# EAGLE design 7seg-2.54 (EAGLE 7.2.0)
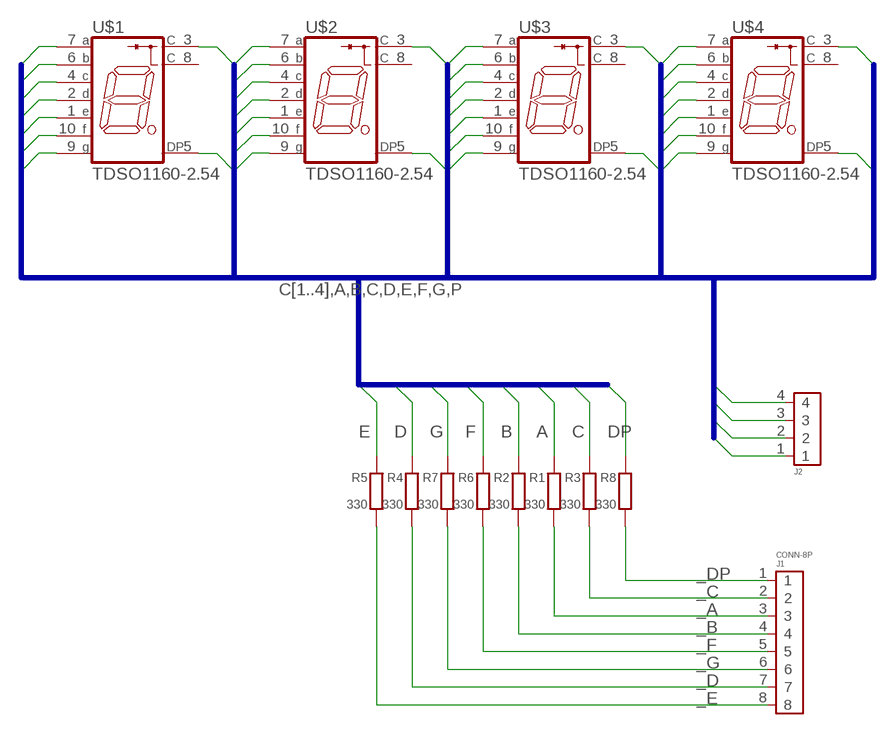
[diagram p0: schematic, sheet 1]

## Parts
J1  CONN-8P  [CONN-8P]
J2  CONN-4P-4P  [CONN-4P]
R1  330  R0202/5-V  [0202/5-V]
R2  330  R0202/5-V  [0202/5-V]
R3  330  R0202/5-V  [0202/5-V]
R4  330  R0202/5-V  [0202/5-V]
R5  330  R0202/5-V  [0202/5-V]
R6  330  R0202/5-V  [0202/5-V]
R7  330  R0202/5-V  [0202/5-V]
R8  330  R0202/5-V  [0202/5-V]
U$1  TDSO1160-2.54  [TDSX1150-2.54]
U$2  TDSO1160-2.54  [TDSX1150-2.54]
U$3  TDSO1160-2.54  [TDSX1150-2.54]
U$4  TDSO1160-2.54  [TDSX1150-2.54]

## Nets
_A: J1.3 R1.2
_B: J1.4 R2.2
_C: J1.2 R3.2
_D: J1.7 R4.2
_DP: J1.1 R8.2
_E: J1.8 R5.2
_F: J1.5 R6.2
_G: J1.6 R7.2
A: R1.1 U$1.7(A) U$2.7(A) U$3.7(A) U$4.7(A)
B: R2.1 U$1.6(B) U$2.6(B) U$3.6(B) U$4.6(B)
C: R3.1 U$1.4(C) U$2.4(C) U$3.4(C) U$4.4(C)
C1: J2.1 U$1.3(C)
C2: J2.2 U$2.3(C)
C3: J2.3 U$3.3(C)
C4: J2.4 U$4.3(C)
D: R4.1 U$1.2(D) U$2.2(D) U$3.2(D) U$4.2(D)
DP: R8.1 U$1.5(DP) U$2.5(DP) U$3.5(DP) U$4.5(DP)
E: R5.1 U$1.1(E) U$2.1(E) U$3.1(E) U$4.1(E)
F: R6.1 U$1.10(F) U$2.10(F) U$3.10(F) U$4.10(F)
G: R7.1 U$1.9(G) U$2.9(G) U$3.9(G) U$4.9(G)
Unconnected: U$1.8(C) U$2.8(C) U$3.8(C) U$4.8(C)

## Buses
C[1..4],A,B,C,D,E,F,G,P

## Library data of the parts
J1 = pinconn:CONN-8P
J2 = pinconn:CONN-4P
R1-R8 = r:R: RESISTOR, European symbol
U$1-U$4 = lcd:TDSO1160

## Board
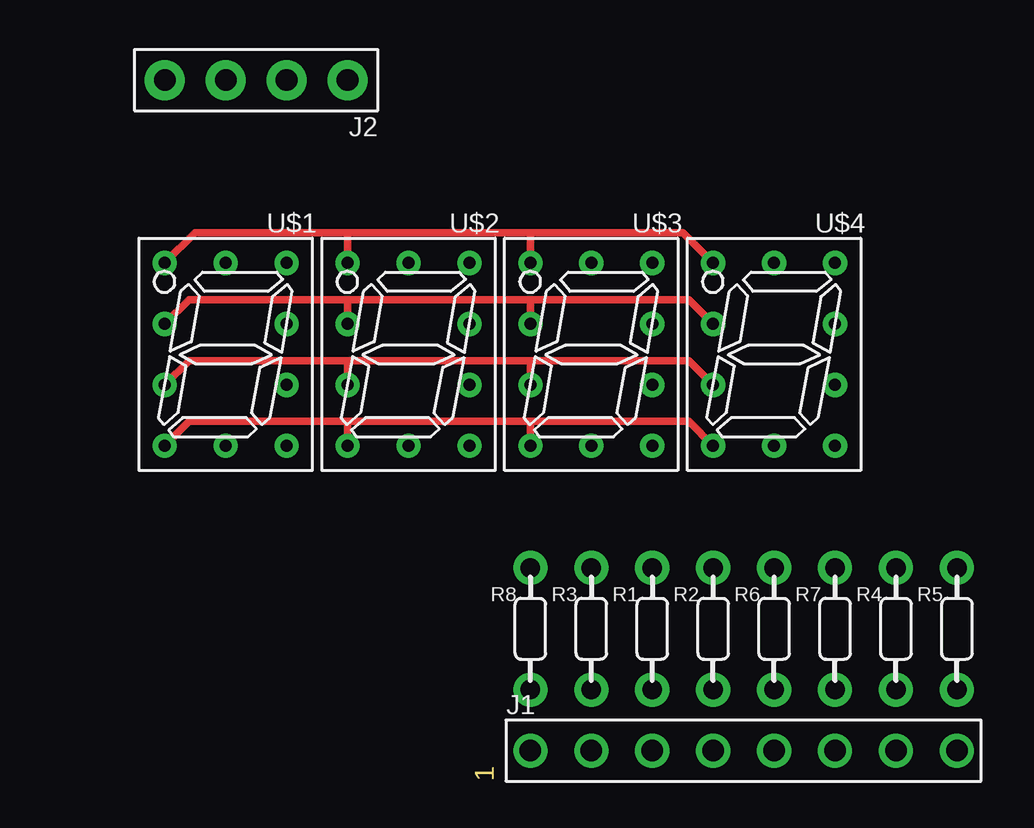
[diagram p1: board, top side]
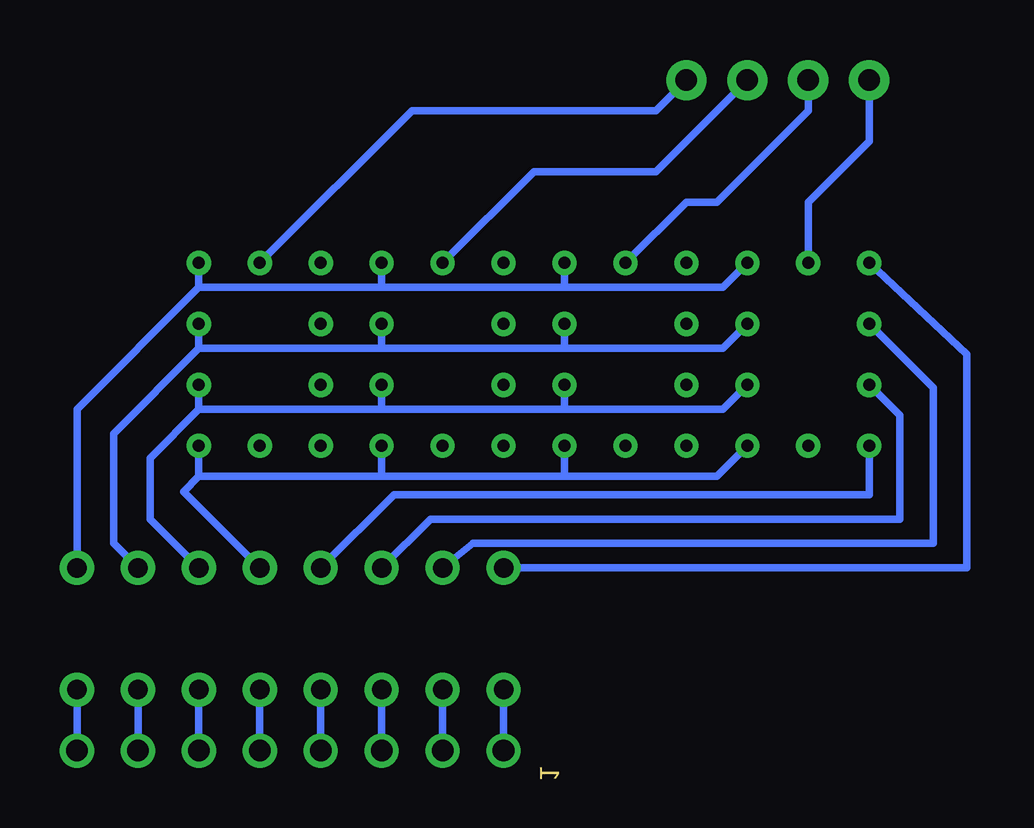
[diagram p2: board, bottom side, seen from below]

No outline drawn. Coordinates in mm, seen from the top.
Copper layers (1*16): Top 0.035mm / dielectric 1.5mm / Bottom 0.035mm
Design rules "default": minimum track width 10mil, minimum drill 24mil, track to track 8mil, track to pad 8mil, pad to pad 8mil, via to via 8mil, smd to smd 8mil, copper to edge 40mil, drill to drill 8mil, minimum pad ring 10mil, minimum via ring 8mil, stop-mask expansion 4mil, vias tented up to drill 0mil, thermal gap 10mil

### Footprints (pad centres in the part's own frame; a part is rotated, then mirrored left to right if it is on the bottom)
CONN-8P = drill 0.9 pad 1.422: 1 0,0; 2 2.54,0; 3 5.08,0; 4 7.62,0; 5 10.16,0; 6 12.7,0; 7 15.24,0; 8 17.78,0
CONN-4P = drill 0.9 pad 1.676: 1 -3.81,0; 2 -1.27,0; 3 1.27,0; 4 3.81,0
0202/5-V = drill 0.813 pad 1.422: 1 0,2.54; 2 0,-2.54
TDSX1150-2.54 = drill 0.5: 1 -2.54,-3.81; 2 -2.54,-1.27; 3 0,-3.81; 4 2.54,-1.27; 5 2.54,-3.81; 6 2.54,3.81; 7 2.54,1.27; 8 0,3.81; 9 -2.54,1.27; 10 -2.54,3.81

### Placement (x,y rotation side)
J1  20.32,2.54 0 top
J2  8.89,30.48 0 top
R1  25.4,7.62 0 top
R2  27.94,7.62 0 top
R3  22.86,7.62 0 top
R4  35.56,7.62 0 top
R5  38.1,7.62 0 top
R6  30.48,7.62 0 top
R7  33.02,7.62 0 top
R8  20.32,7.62 0 top
U$1  7.62,19.05 180 top
U$2  15.24,19.05 180 top
U$3  22.86,19.05 180 top
U$4  30.48,19.05 180 top

### Tracks (layer width: path | path; a pad name or v marks a point on that pad's centre or on a via)
_A
  Bottom 0.305: J1.3 R1.2
_B
  Bottom 0.305: R2.2 J1.4
_C
  Bottom 0.305: R3.2 J1.2
_D
  Bottom 0.305: R4.2 J1.7
_DP
  Bottom 0.305: J1.1 R8.2
_E
  Bottom 0.305: J1.8 R5.2
_F
  Bottom 0.305: J1.5 R6.2
_G
  Bottom 0.305: R7.2 J1.6
A
  Top 0.305: U$1.7 6.1,18.8 9.48,18.8 12.7,18.8 | 12.7,18.8 U$2.7 | U$3.7 | U$3.7 20.32,18.8 | 20.32,18.8 12.7,18.8 | U$4.7 | U$4.7 26.92,18.8 20.32,18.8
  Bottom 0.305: R1.1 23.37,12.19 3.81,12.19 3.81,16.51 U$1.7
B
  Top 0.305: U$1.6 6.1,16.26 12.7,16.26 | U$2.6 12.7,16.26 | 12.7,16.26 20.32,16.26 | U$3.6 20.32,16.26 | 20.32,16.26 26.92,16.26 U$4.6
  Bottom 0.305: R2.1 24.89,13.21 5.08,13.21 U$1.6
C
  Top 0.305: U$1.4 | U$1.4 6.1,21.34 12.7,21.34 | 12.7,21.34 | 12.7,21.34 U$2.4 | U$2.4 | 12.7,21.34 20.32,21.34 | 20.32,21.34 | 20.32,21.34 U$3.4 | U$3.4 | U$3.4 20.32,21.34 | 20.32,21.34 26.92,21.34 U$4.4
  Bottom 0.305: U$1.4 | U$1.4 | U$1.4 2.41,17.65 2.41,11.18 21.59,11.18 R3.1
C1
  Bottom 0.305: J2.1 5.08,27.94 7.62,25.4 U$1.3
C2
  Bottom 0.305: J2.2 7.62,29.21 11.43,25.4 12.7,25.4 U$2.3
C3
  Bottom 0.305: J2.3 13.97,26.67 19.05,26.67 U$3.3
C4
  Bottom 0.305: J2.4 13.97,29.21 24.13,29.21 U$4.3
D
  Bottom 0.305: R4.1 36.58,11.18 36.58,15.75 33.02,19.3 | 33.02,19.3 U$4.2 33.02,19.3 | U$1.2 | U$1.2 11.18,19.3 17.78,19.3 | 17.78,19.3 U$2.2 17.78,19.3 | 33.02,19.3 25.4,19.3 | 25.4,19.3 | 25.4,19.3 U$3.2 | U$3.2 | U$3.2 25.4,19.3 | 25.4,19.3 17.78,19.3 | 17.78,19.3
DP
  Top 0.305: U$1.5 | U$1.5 6.35,24.13 11.43,24.13 | 12.7,24.13 11.43,24.13 | 12.7,24.13 U$2.5 | U$2.5 | U$2.5 12.7,24.13 | 11.43,24.13 12.7,24.13 | 12.7,24.13 12.06,24.13 | 12.06,24.13 | 12.06,24.13 20.32,24.13 | 20.32,24.13 | 20.32,24.13 U$3.5 | U$3.5 | U$3.5 20.32,24.13 | 20.32,24.13 26.67,24.13 U$4.5
  Bottom 0.305: R8.1 1.02,10.16 1.02,19.05 U$1.5 | U$1.5 | U$1.5
E
  Bottom 0.305: R5.1 38.1,16.76 33.02,21.84 | 33.02,21.84 | 33.02,21.84 U$4.1 | U$4.1 | U$1.1 | U$1.1 11.18,21.84 17.78,21.84 | 17.78,21.84 | 17.78,21.84 U$2.1 | U$2.1 | U$2.1 17.78,21.84 | 17.78,21.84 25.4,21.84 | 25.4,21.84 U$3.1 | U$3.1 | U$3.1 25.4,21.84 | 25.4,21.84 | 25.4,21.84 33.02,21.84 | 33.02,21.84 U$4.1
F
  Bottom 0.305: U$1.10 11.43,13.97 17.78,13.97 | U$2.10 17.78,13.97 | 17.78,13.97 25.4,13.97 | U$3.10 25.4,13.97 | 25.4,13.97 33.02,13.97 | R6.1 33.66,13.34 33.02,13.97 | 33.02,13.97 U$4.10
G
  Bottom 0.305: R7.1 35.05,12.19 35.05,14.73 33.02,16.76 | U$1.9 | U$1.9 11.18,16.76 17.78,16.76 | U$2.9 17.78,16.76 | 17.78,16.76 25.4,16.76 | 25.4,16.76 U$3.9 | U$3.9 | U$3.9 25.4,16.76 | 25.4,16.76 | 25.4,16.76 33.02,16.76 | 33.02,16.76 | 33.02,16.76 U$4.9